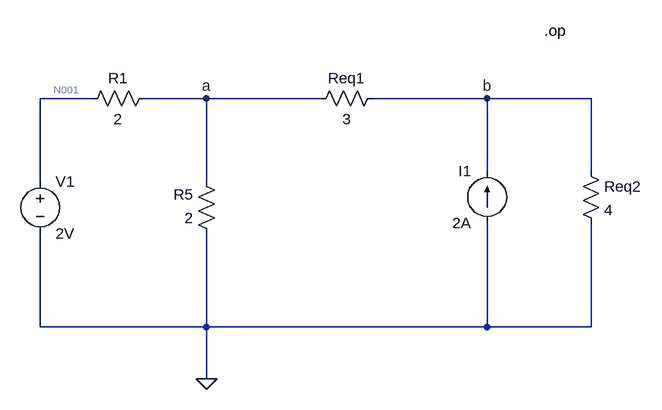
[diagram p0: schematic simplifié.asc]
simplifié.asc, the LTspice schematic file:
Version 4
SHEET 1 880 680
WIRE -144 32 -224 32
WIRE 32 32 -64 32
WIRE 208 32 32 32
WIRE 464 32 288 32
WIRE 624 32 464 32
WIRE 464 144 464 32
WIRE 624 144 624 32
WIRE -224 160 -224 32
WIRE 32 160 32 32
WIRE -224 384 -224 240
WIRE 32 384 32 240
WIRE 32 384 -224 384
WIRE 464 384 464 224
WIRE 464 384 32 384
WIRE 624 384 624 224
WIRE 624 384 464 384
WIRE 32 464 32 384
FLAG 32 464 0
FLAG 32 32 a
FLAG 464 32 b
SYMBOL current 464 224 R180
WINDOW 0 24 80 Left 2
WINDOW 3 24 0 Left 2
SYMATTR InstName I1
SYMATTR Value 2A
SYMBOL voltage -224 144 R0
SYMATTR InstName V1
SYMATTR Value 2V
SYMBOL res 304 16 R90
WINDOW 0 0 56 VBottom 2
WINDOW 3 32 56 VTop 2
SYMATTR InstName Req1
SYMATTR Value 3
SYMBOL res 48 256 R180
WINDOW 0 36 76 Left 2
WINDOW 3 36 40 Left 2
SYMATTR InstName R5
SYMATTR Value 2
SYMBOL res -48 16 R90
WINDOW 0 0 56 VBottom 2
WINDOW 3 32 56 VTop 2
SYMATTR InstName R1
SYMATTR Value 2
SYMBOL res 608 128 R0
SYMATTR InstName Req2
SYMATTR Value 4
TEXT 552 -72 Left 2 !.op

The netlist it stands for:
* simplifié.asc
I1 0 b 2A
V1 N001 0 2V
Req1 b a 3
R5 0 a 2
R1 a N001 2
Req2 b 0 4
.op
.backanno
.end

* Results of the author's LTspice run, read from the files saved beside the schematic
* Operating Point:
*   V(b) = 4.5 V
*   V(n001) = 2 V
*   V(a) = 1.875 V
*   I(I1) = 2 A
*   I(Req2) = 1.125 A
*   I(R1) = -62.5 mA
*   I(R5) = -937.5 mA
*   I(Req1) = 875 mA
*   I(V1) = -62.5 mA